# EAGLE design BatteryManagement (EAGLE 9.6.2)
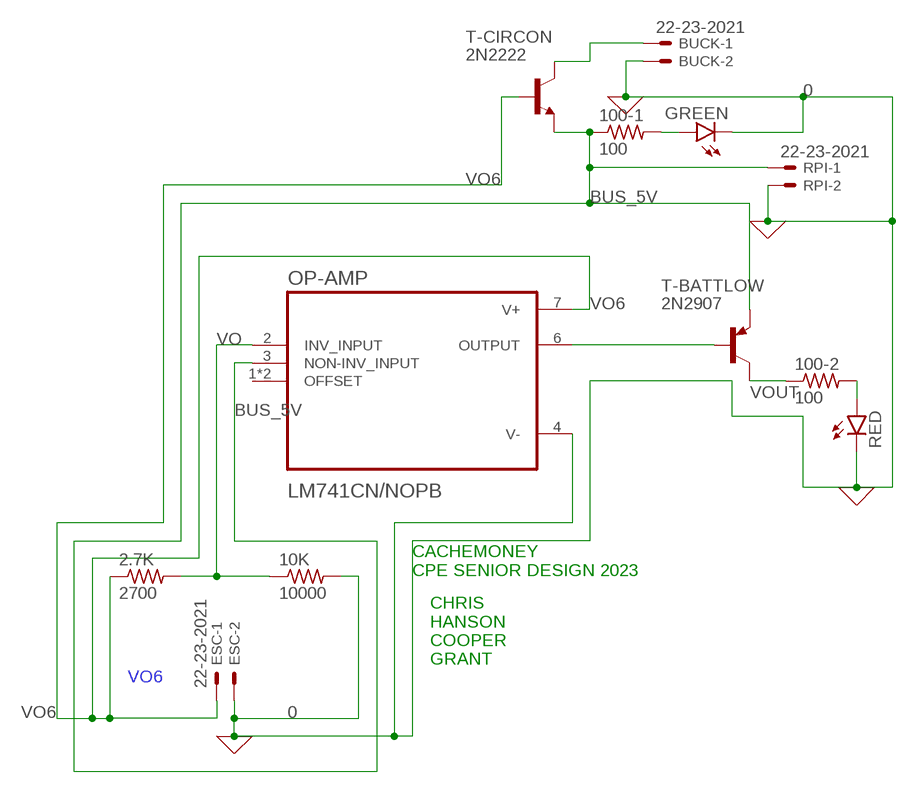
[diagram p0: schematic, sheet 1]

## Parts
2.7K  2700  R-US_0204/7  [0204/7]
10K  10000  R-US_0204/7  [0204/7]
100-1  100  R-US_0204/7  [0204/7]
100-2  100  R-US_0204/7  [0204/7]
BUCK  22-23-2021  [22-23-2021]
ESC  22-23-2021  [22-23-2021]
GREEN  LED5MM  [LED5MM]
OP-AMP  LM741CN/NOPB  [DIP794W45P254L959H508Q8]
RED  LED5MM  [LED5MM]
RPI  22-23-2021  [22-23-2021]
T-BATTLOW  2N2907  [TO18]
T-CIRCON  2N2222  [TO18]

## Nets
0: 10K.2 BUCK.2 ESC.2 GREEN.K(C) OP-AMP.4(V-) RED.K(C) RPI.2 ; supply symbol labelled GND
BUS_5V: 100-1.1 OP-AMP.3(NON-INV_INPUT) RPI.1 T-BATTLOW.1(E) T-CIRCON.1(E)
N$5: BUCK.1 T-CIRCON.3(C)
N$7: 100-1.2 GREEN.A
N$9: OP-AMP.6(OUTPUT) T-BATTLOW.2(B)
N$11: 100-2.2 RED.A
VO: 2.7K.2 10K.1 OP-AMP.2(INV_INPUT)
VO6: 2.7K.1 ESC.1 OP-AMP.7(V+) T-CIRCON.2(B)
VOUT: 100-2.1 T-BATTLOW.3(C)
Unconnected: OP-AMP.1(OFFSET) OP-AMP.5(OFFSET)

## Notes on the sheet
- CACHEMONEY
  CPE SENIOR DESIGN 2023
- CHRIS
  HANSON
  COOPER
  GRANT

## Library data of the parts
2.7K 10K 100-1 100-2 = rcl:R-US_: RESISTOR, American symbol; SPICEPREFIX: R
BUCK ESC RPI = con-molex:22-23-2021: .100" (2.54mm) Center Header - 2 Pin; MF: MOLEX; MPN: 22-23-2021; OC_FARNELL: 1462926; OC_NEWARK: 25C3832
GREEN RED = led:LED: LED OSRAM: - CHIPLED LG R971, LG N971, LY N971, LG Q971, LY Q971, LO R971, LY R971 LH N974, LH R974 LS Q976, LO Q976, LY Q976 LO Q996 - Hyper CHIPLED LW Q18S LB Q993, LB Q99A, LB R99A - SideLED LS A670, LO A670, LY A670, LG A670, LP A670 LB A673, LV A673, LT A673, LW A673 LH A674 LY A675 LS A676, LA A676, LO A676, LY A676, LW A676 LS A679, LY A679, LG A679 - Hyper Micro SIDELED® LS Y876, LA Y876, LO Y876, LY Y876 LT Y87S - SmartLED LW L88C, LW L88S LB L89C, LB L89S, LG L890 LS L89K, LO L89K, LY L89K LS L896, LA L896, LO L896, LY L896 - TOPLED LS T670, LO T670, LY T670, LG T670, LP T670 LSG T670, LSP T670, LSY T670, LOP T670, LYG T670 LG T671, LOG T671, LSG T671 LB T673, LV T673, LT T673, LW T673 LH T674 LS T676, LA T676, LO T676, LY T676, LB T676, LH T676, LSB T676, LW T676 LB T67C, LV T67C, LT T67C, LS T67K, LO T67K, LY T67K, LW E67C LS E67B, LA E67B, LO E67B, LY E67B, LB E67C, LV E67C, LT E67C LW T67C LS T679, LY T679, LG T679 LS T770, LO T770, LY T770, LG T770, LP T770 LB T773, LV T773, LT T773, LW T773 LH T774 LS E675, LA E675, LY E675, LS T675 LS T776, LA T776, LO T776, LY T776, LB T776 LHGB T686 LT T68C, LB T68C - Hyper Mini TOPLED® LB M676 - Mini TOPLED Santana® LG M470 LS M47K, LO M47K, LY M47K Source: http://www.osram.convergy.de LUXEON: - LUMILED® LXK2-PW12-R00, LXK2-PW12-S00, LXK2-PW14-U00, LXK2-PW14-V00 LXK2-PM12-R00, LXK2-PM12-S00, LXK2-PM14-U00 LXK2-PE12-Q00, LXK2-PE12-R00, LXK2-PE12-S00, LXK2-PE14-T00, LXK2-PE14-U00 LXK2-PB12-K00, LXK2-PB12-L00, LXK2-PB12-M00, LXK2-PB14-N00, LXK2-PB14-P00, LXK2-PB14-Q00 LXK2-PR12-L00, LXK2-PR12-M00, LXK2-PR14-Q00, LXK2-PR14-R00 LXK2-PD12-Q00, LXK2-PD12-R00, LXK2-PD12-S00 LXK2-PH12-R00, LXK2-PH12-S00 LXK2-PL12-P00, LXK2-PL12-Q00, LXK2-PL12-R00 Source: www.luxeon.com KINGBRIGHT: KA-3528ASYC Source: www.kingbright.com
OP-AMP = LM741CN_NOPB:LM741CN/NOPB: Check availability <https://pricing.snapeda.com/parts/LM741CN/Texas%20Instruments/view-part?ref=eda>; AVAILABILITY: In Stock; CHECK_PRICES: https://www.snapeda.com/parts/LM741CN/Texas+Instruments/view-part/?ref=eda; DESCRIPTION: Operational Amplifiers - Op Amps Operational Amplifier 8-PDIP 0 to 70; MF: Texas Instruments; MP: LM741CN; PACKAGE: DIP-8 NXP Semiconductors; PRICE: None; PURCHASE-URL: https://www.snapeda.com/api/url_track_click_mouser/?unipart_id=226044&manufacturer=Texas Instruments&part_name=LM741CN&search_term=lm741; SNAPEDA_LINK: https://www.snapeda.com/parts/LM741CN/Texas+Instruments/view-part/?ref=snap
T-BATTLOW = transistor-pnp:2N2907*: PNP Transistor
T-CIRCON = transistor:2N2222: NPN TRANSISTOR

## Board
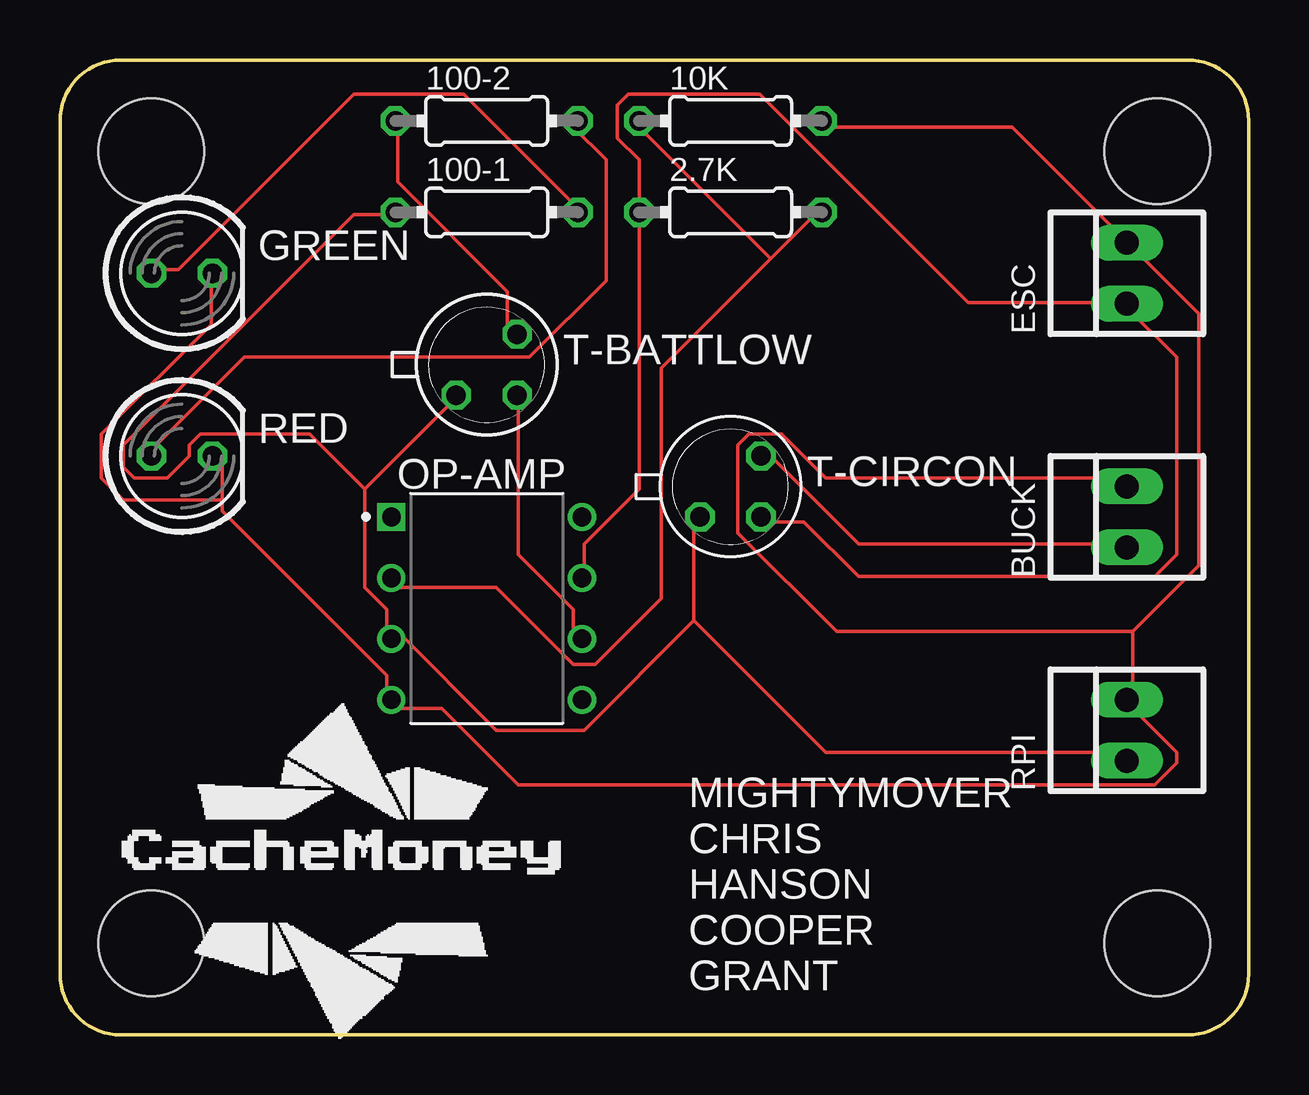
[diagram p1: board, top side]

Size 49.53 x 40.64 mm. Coordinates in mm from the lower left corner, seen from the top.
Outline: 49.53,38.1 arc90 46.99,40.64 2.54,40.64 arc90 0,38.1 0,2.54 arc90 2.54,0 46.99,0 arc90 49.53,2.54 49.53,38.1
Copper layers (1*16): Top 0.035559375mm / dielectric 1.6mm / Bottom 0.035559375mm
Design rules "OshParkDRU *": minimum track width 6mil, minimum drill 10mil, track to track 30mil, track to pad 6mil, pad to pad 6mil, via to via 6mil, smd to smd 6mil, copper to edge 15mil, drill to drill 6mil, minimum pad ring 5mil, minimum via ring 5mil, stop-mask expansion 2.5mil, vias tented up to drill 0mil, thermal gap 10mil
Holes 4.4 mm at 3.81,36.83 45.72,36.83 45.72,3.81 3.81,3.81

### Footprints (pad centres in the part's own frame; a part is rotated, then mirrored left to right if it is on the bottom)
0204/7 = drill 0.813 octagon: 1 -3.81,0; 2 3.81,0
22-23-2021 = drill 1 long: 1 -1.27,0; 2 1.27,0
LED5MM = drill 0.813 octagon: A -1.27,0; K 1.27,0
DIP794W45P254L959H508Q8 = drill 0.78 pad 1.13 square: 1 -3.97,3.81 | drill 0.78 pad 1.13: 2 -3.97,1.27; 3 -3.97,-1.27; 4 -3.97,-3.81; 5 3.97,-3.81; 6 3.97,-1.27; 7 3.97,1.27; 8 3.97,3.81
TO18 = drill 0.813 octagon: 1 -1.27,-1.27; 2 1.27,-1.27; 3 1.27,1.27

### Placement (x,y rotation side)
2.7K  27.94,34.29 0 top
10K  27.94,38.1 0 top
100-1  17.78,34.29 0 top
100-2  17.78,38.1 0 top
BUCK  44.45,21.59 90 top
ESC  44.45,31.75 90 top
GREEN  5.08,31.75 0 top
OP-AMP  17.78,17.78 0 top
RED  5.08,24.13 0 top
RPI  44.45,12.7 90 top
T-BATTLOW  17.78,27.94 0 top
T-CIRCON  27.94,22.86 0 top

### Tracks (layer width: path | path; a pad name or v marks a point on that pad's centre or on a via)
0
  Top 0.152: 6.76,22.3 6.76,24.13 RED.K | 6.76,22.3 6.76,21.84 13.61,14.99 13.61,14.07 OP-AMP.4 14.07,13.61 15.9,13.61 19.1,10.41 45.62,10.41 46.53,11.33 46.53,11.79 44.7,13.61 RPI.2 44.7,14.07 44.7,16.82 | 6.76,22.3 2.64,22.3 1.73,23.22 1.73,25.04 6.3,29.62 6.3,31.45 GREEN.K | 10K.2 31.9,37.85 39.68,37.85 44.25,33.27 ESC.2 44.7,32.82 47.45,30.07 47.45,19.56 44.7,16.82 | 44.7,16.82 32.36,16.82 28.25,20.93 28.25,24.59 28.7,25.04 30.07,25.04 31.9,23.22 44.25,23.22 BUCK.2
BUS_5V
  Top 0.152: 12.7,22.76 12.7,18.64 13.61,17.73 13.61,16.82 OP-AMP.3 14.07,16.82 18.19,12.7 21.84,12.7 26.42,17.27 | 12.7,22.76 16.36,26.42 T-BATTLOW.1 | 12.7,22.76 10.41,25.04 5.84,25.04 5.38,24.59 5.38,24.13 4.47,23.22 3.1,23.22 2.64,23.67 2.64,24.59 12.24,34.19 13.61,34.19 100-1.1 | 26.42,17.27 26.42,21.39 T-CIRCON.1 | 26.42,17.27 31.9,11.79 44.25,11.79 RPI.1
N$5
  Top 0.152: T-CIRCON.3 29.62,24.13 33.27,20.47 44.25,20.47 BUCK.1
N$7
  Top 0.152: GREEN.A 4.01,31.9 4.93,31.9 12.24,39.22 16.82,39.22 21.39,34.65 100-1.2
N$9
  Top 0.152: OP-AMP.6 21.39,16.82 21.39,17.73 19.1,20.02 19.1,26.42 T-BATTLOW.2
N$11
  Top 0.152: RED.A 4.01,24.13 4.01,24.59 7.67,28.25 19.56,28.25 22.76,31.45 22.76,36.47 21.39,37.85 100-2.2
VO
  Top 0.152: 29.62,32.36 31.45,34.19 2.7K.2 | 29.62,32.36 25.04,27.79 25.04,18.19 22.3,15.44 21.39,15.44 18.19,18.64 14.07,18.64 OP-AMP.2 | 29.62,32.36 24.13,37.85 10K.1
VO6
  Top 0.152: OP-AMP.7 21.84,19.1 21.84,20.47 24.13,22.76 2.7K.1 24.13,36.47 23.22,37.39 23.22,38.76 23.67,39.22 29.16,39.22 37.85,30.53 44.25,30.53 ESC.1 44.7,30.07 46.53,28.25 46.53,20.02 45.62,19.1 33.27,19.1 30.99,21.39 29.62,21.39 T-CIRCON.2
VOUT
  Top 0.152: 100-2.1 14.07,37.85 14.07,35.56 18.64,30.99 18.64,29.62 T-BATTLOW.3

### Text on the board
tPlace: MIGHTYMOVER / CHRIS / HANSON / COOPER / GRANT